# Altium schematic sheet 3+6axis.SchDoc
size A; SheetNumber: 1; SheetTotal: 5
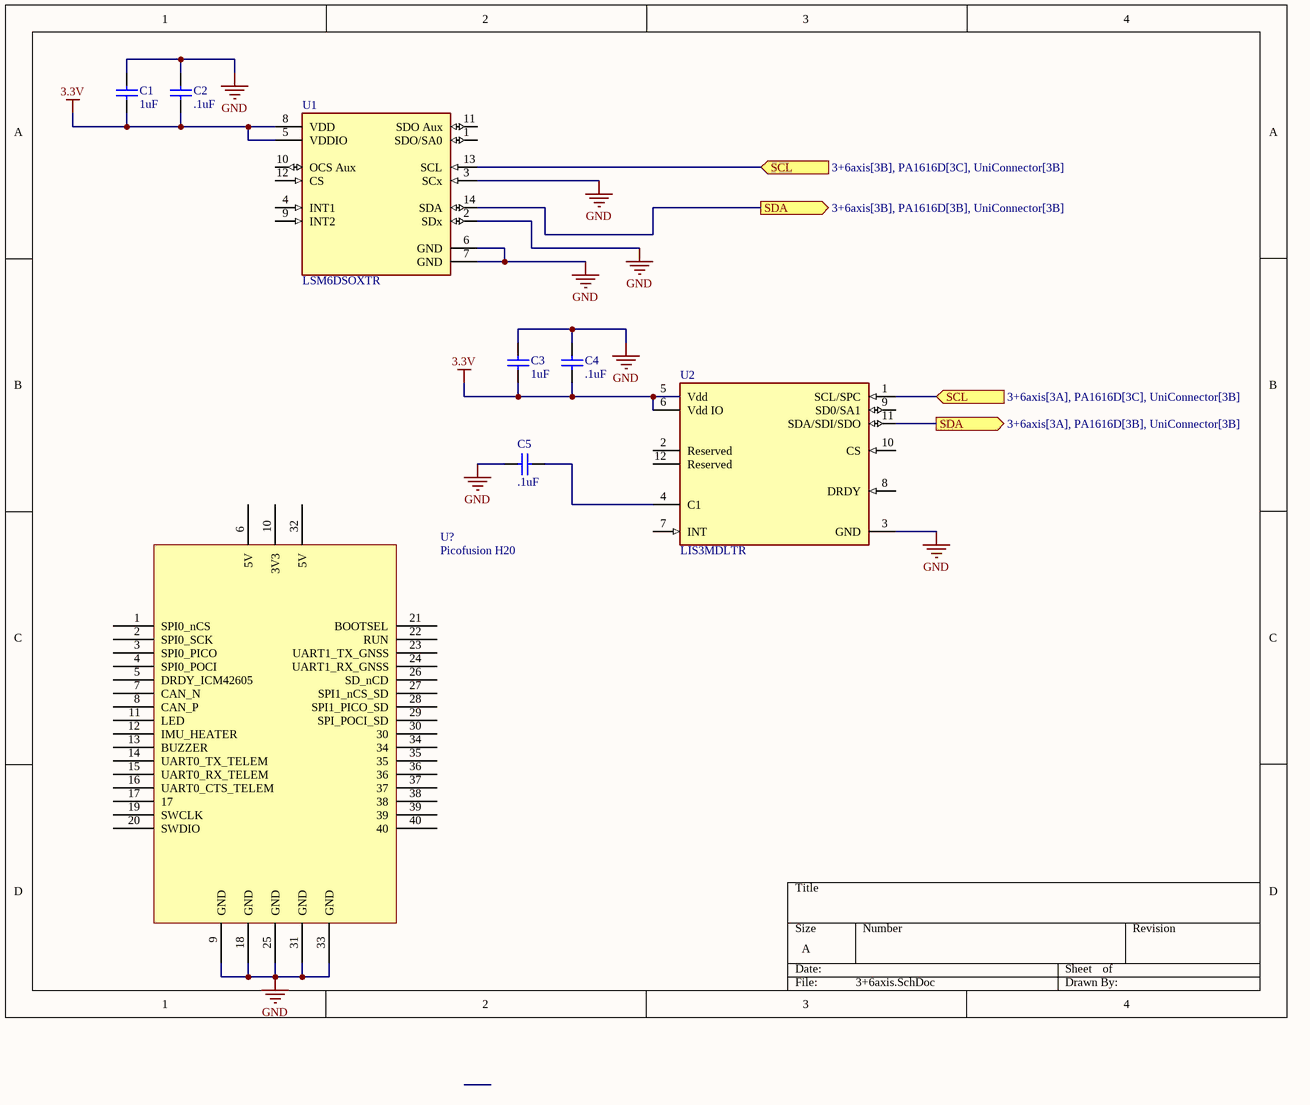
[diagram p0: 3+6axis.SchDoc]

## Parts
C1  1uF  [CAPC2013X145X48ML20T23]
C2  .1uF  [CAPC2013X145X48ML20T23]
C3  1uF  [CAPC2013X145X48ML20T23]
C4  .1uF  [CAPC2013X145X48ML20T23]
C5  .1uF  [CAPC2013X145X48ML20T23]
U1  LSM6DSOXTR  [FP-LGA-14L-DM00249496-MFG]
U2  LIS3MDLTR  [FP-VFLGA-12-8365767-MFG]
U?  Picofusion H20  [PicoFusion H Series]

## Ports
SCL (in, see 3+6axis[3A], PA1616D[3C], UniConnector[3B]), SCL (in, see 3+6axis[3B], PA1616D[3C], UniConnector[3B]), SDA (out, see 3+6axis[3A], PA1616D[3B], UniConnector[3B]), SDA (out, see 3+6axis[3B], PA1616D[3B], UniConnector[3B])

## Nets
3.3V: C1.1 C2.1 C3.1 C4.1 U1.5(VDDIO) U1.8(VDD) U2.5(Vdd) U2.6(Vdd_IO)
GND: C1.2 C2.2 C3.2 C4.2 C5.1 U1.2(SDx) U1.3(SCx) U1.6(GND) U1.7(GND) U2.3(GND) U?.9(GND) U?.18(GND) U?.25(GND) U?.31(GND) U?.33(GND)
SCL: U1.13(SCL) U2.1(SCL/SPC) ; port SCL
SDA: U1.14(SDA) U2.11(SDA/SDI/SDO) ; port SDA
NetC5_2: C5.2 U2.4(C1)

Not connected (* = marked no-connect by the designer): U1 1(SDO/SA0) 4(INT1) 9(INT2) 10(OCS_Aux) 11(SDO_Aux) 12(CS); U2 2(Reserved) 7(INT) 8(DRDY) 9(SD0/SA1) 10(CS) 12(Reserved); U? 1(SPI0_nCS) 2(SPI0_SCK) 3(SPI0_PICO) 4(SPI0_POCI) 5(DRDY_ICM42605) 6(5V) 7(CAN_N) 8(CAN_P) 10(3V3) 11(LED) 12(IMU_HEATER) 13(BUZZER) 14(UART0_TX_TELEM) 15(UART0_RX_TELEM) 16(UART0_CTS_TELEM) 17 19(SWCLK) 20(SWDIO) 21(BOOTSEL) 22(RUN) 23(UART1_TX_GNSS) 24(UART1_RX_GNSS) 26(SD_nCD) 27(SPI1_nCS_SD) 28(SPI1_PICO_SD) 29(SPI_POCI_SD) 30 32(5V) 34 35 36 37 38 39 40

## Library data of the parts
C1-C5 = CMP-2007-03160-1: Part Number: VJ0805Y103KXBBC31; Manufacturer: Vitramon
U1 = CMP-12177-000010-1: INEMO INERTIAL MODULE: 3D ACCELE; Manufacturer: STMicroelectronics; Sensor Type: Temperature,Accelerometer,Gyroscope; Accel Range: 2/4/8/16g; Accel Sensitivity: 0.061/0.122/0.244/0.488mV/g; Operating Supply Current: 0.55mA; Gyro Range: 125/250/500/1000/2000°/s; Gyro Sensitivity: 4.375/8.75/17.5/35/70LSB/°/s; Sensor Output: I2C,SPI,Other; Min Supply Voltage: 1.62V; Max Supply Voltage: 3.6V; Octopart: https://octopart.com/lsm6dsoxtr-stmicroelectronics-98102600; Package: LGA-14L-DM00249496; Footprint Url: https://www.st.com/content/ccc/resource/technical/document/technical_note/73/17/9c/16/dd/96/4a/01/CD00134799.pdf/files/CD00134799.pdf/jcr:content/translations/en.CD00134799.pdf; ComponentLink2Description: Datasheet; Mouser Description: LSM6DSOX: 3.6 V 3 Axis Accelerometer Gyroscope iNEMO Inertial Module - LGA-14L; ComponentLink2URL: https://www.st.com/resource/en/datasheet/lsm6dsox.pdf; Temperature Range Low: -40°C; Digikey Description: INEMO INERTIAL MODULE: 3D ACCELE; Lead Free: Yes; Device Class L3: Inertial Measurement Units (IMUs); Category: IC; Device Class L2: Motion Sensors; RoHS: TRUE; Temperature: -40°C to +85°C; Height: 0.86mm; Device Class L1: Sensors; Temperature Range High: +85°C; Manufacturer Part Number: LSM6DSOXTR; Automotive: No
U2 = CMP-2000-07463-2: SENSOR MR I2C/SPI 12LGA; Manufacturer: STMicroelectronics; Sensor Output: I2C,SPI; Operating Supply Current: 40-270uA; Max Supply Voltage: 3.6V; Sensing Method: Magnetic; Min Supply Voltage: 1.71V; ComponentLink2URL: https://www.st.com/resource/en/datasheet/lis3mdl.pdf; Category: IC; Manufacturer Part Number: LIS3MDLTR; Octopart: https://octopart.com/lis3mdltr-stmicroelectronics-29403125; Automotive: No; ComponentLink2Description: Datasheet; RoHS: TRUE; Device Class L3: unset; Device Class L1: Sensors; Temperature: -40°C to +85°C; Height: 1mm; Mouser Description: Board Mount Hall Effect / Magnetic Sensors Ultra Lo-Pwr Hi Perf 3-Axis 1.9-3.6V; Temperature Range High: +85°C; Lead Free: Yes; Device Class L2: Magnetic Sensors; Footprint Url: https://www.st.com/content/ccc/resource/technical/document/technical_note/73/17/9c/16/dd/96/4a/01/CD00134799.pdf/files/CD00134799.pdf/jcr:content/translations/en.CD00134799.pdf; Temperature Range Low: -40°C; Package: VFLGA-12-8365767; Digikey Description: SENSOR MR I2C/SPI 12LGA